# Altium schematic sheet STM32G473CET6_PINOUT.SchDoc
size C; SheetNumber: 6; SheetTotal: 6
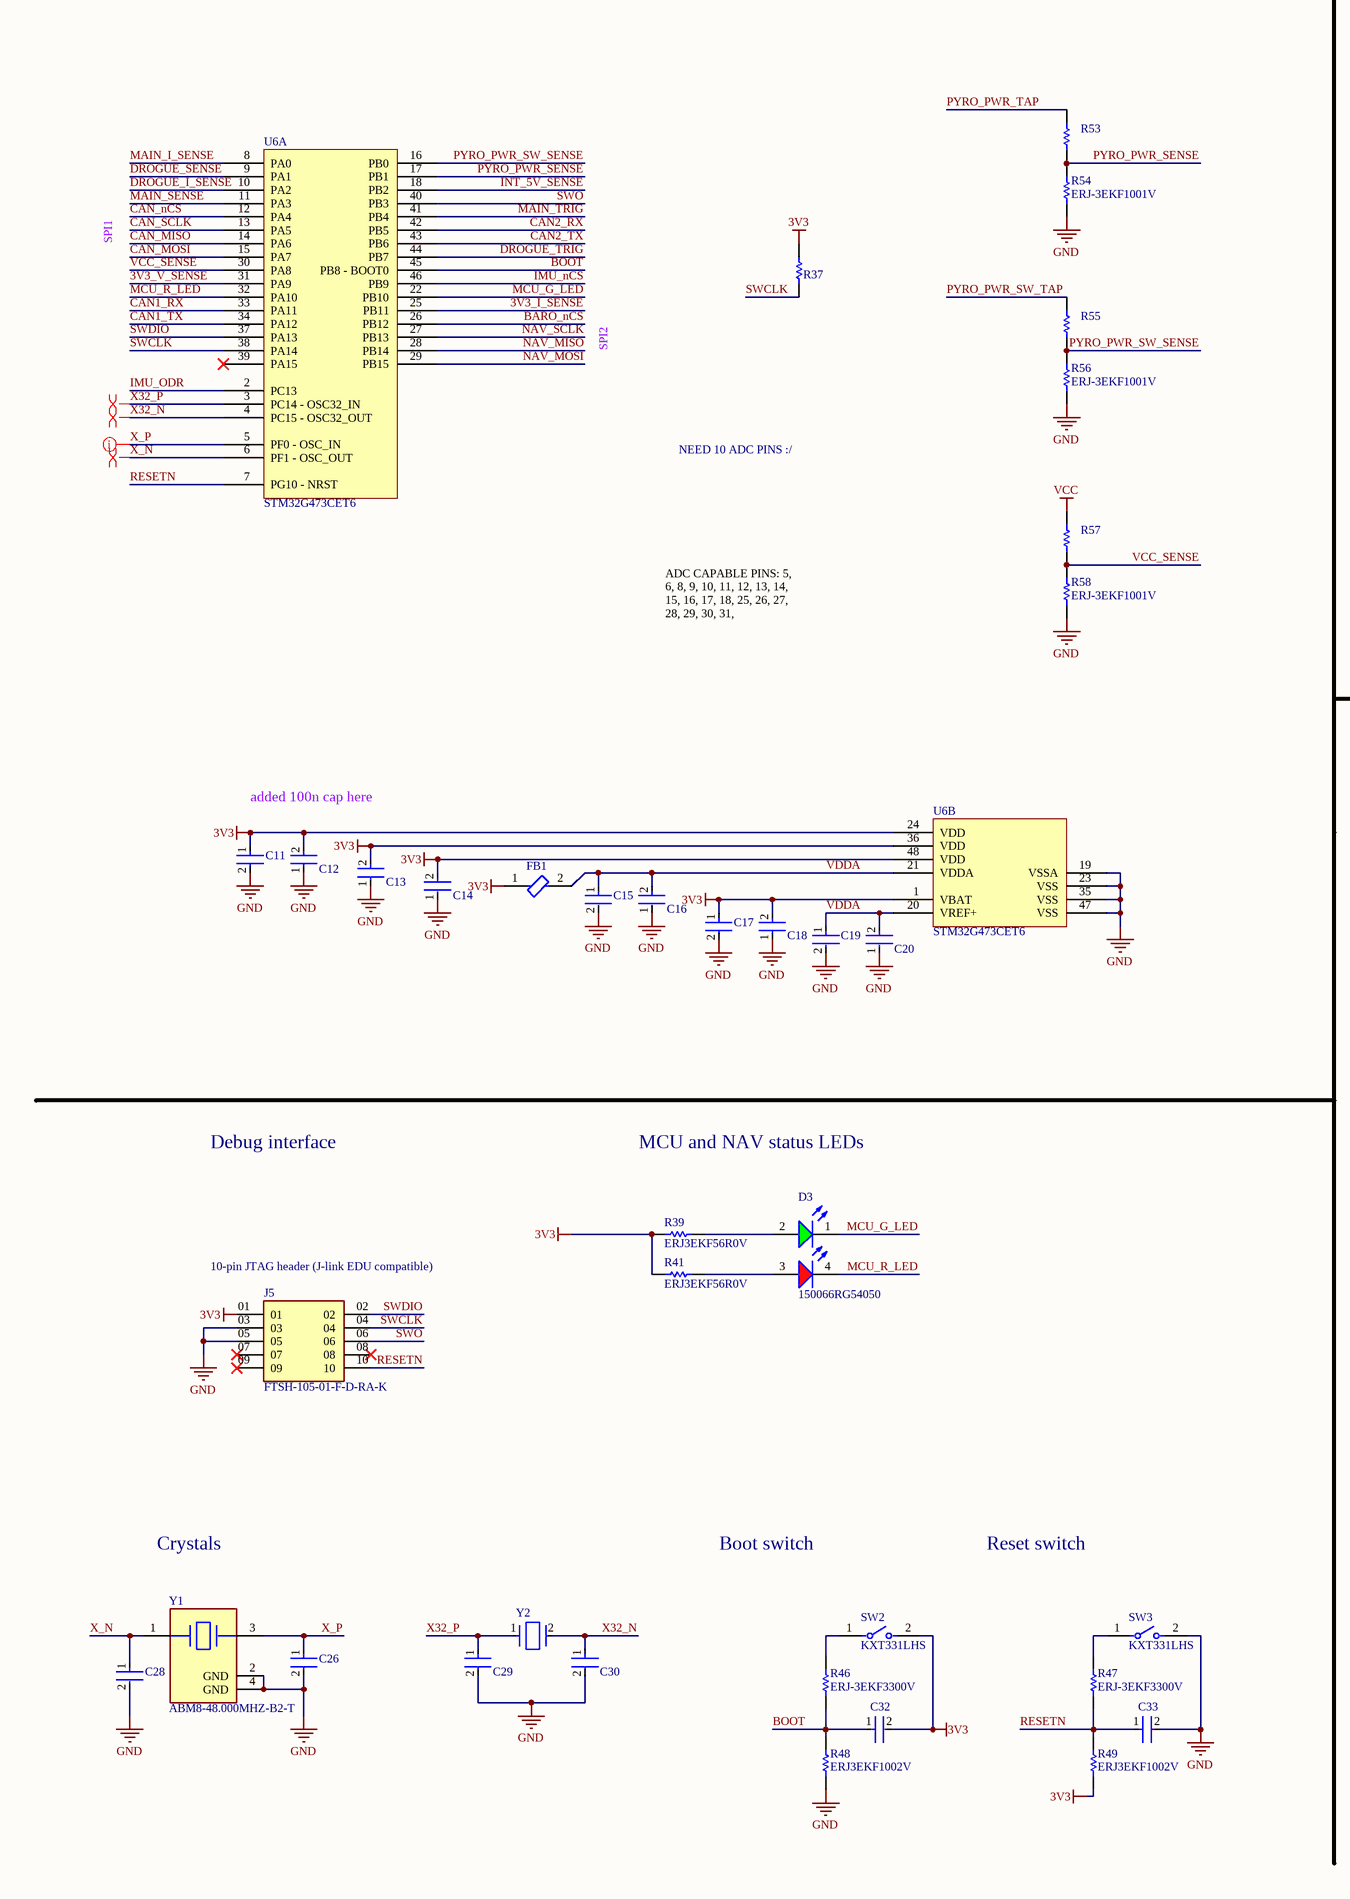
[diagram p0: STM32G473CET6_PINOUT.SchDoc, left]
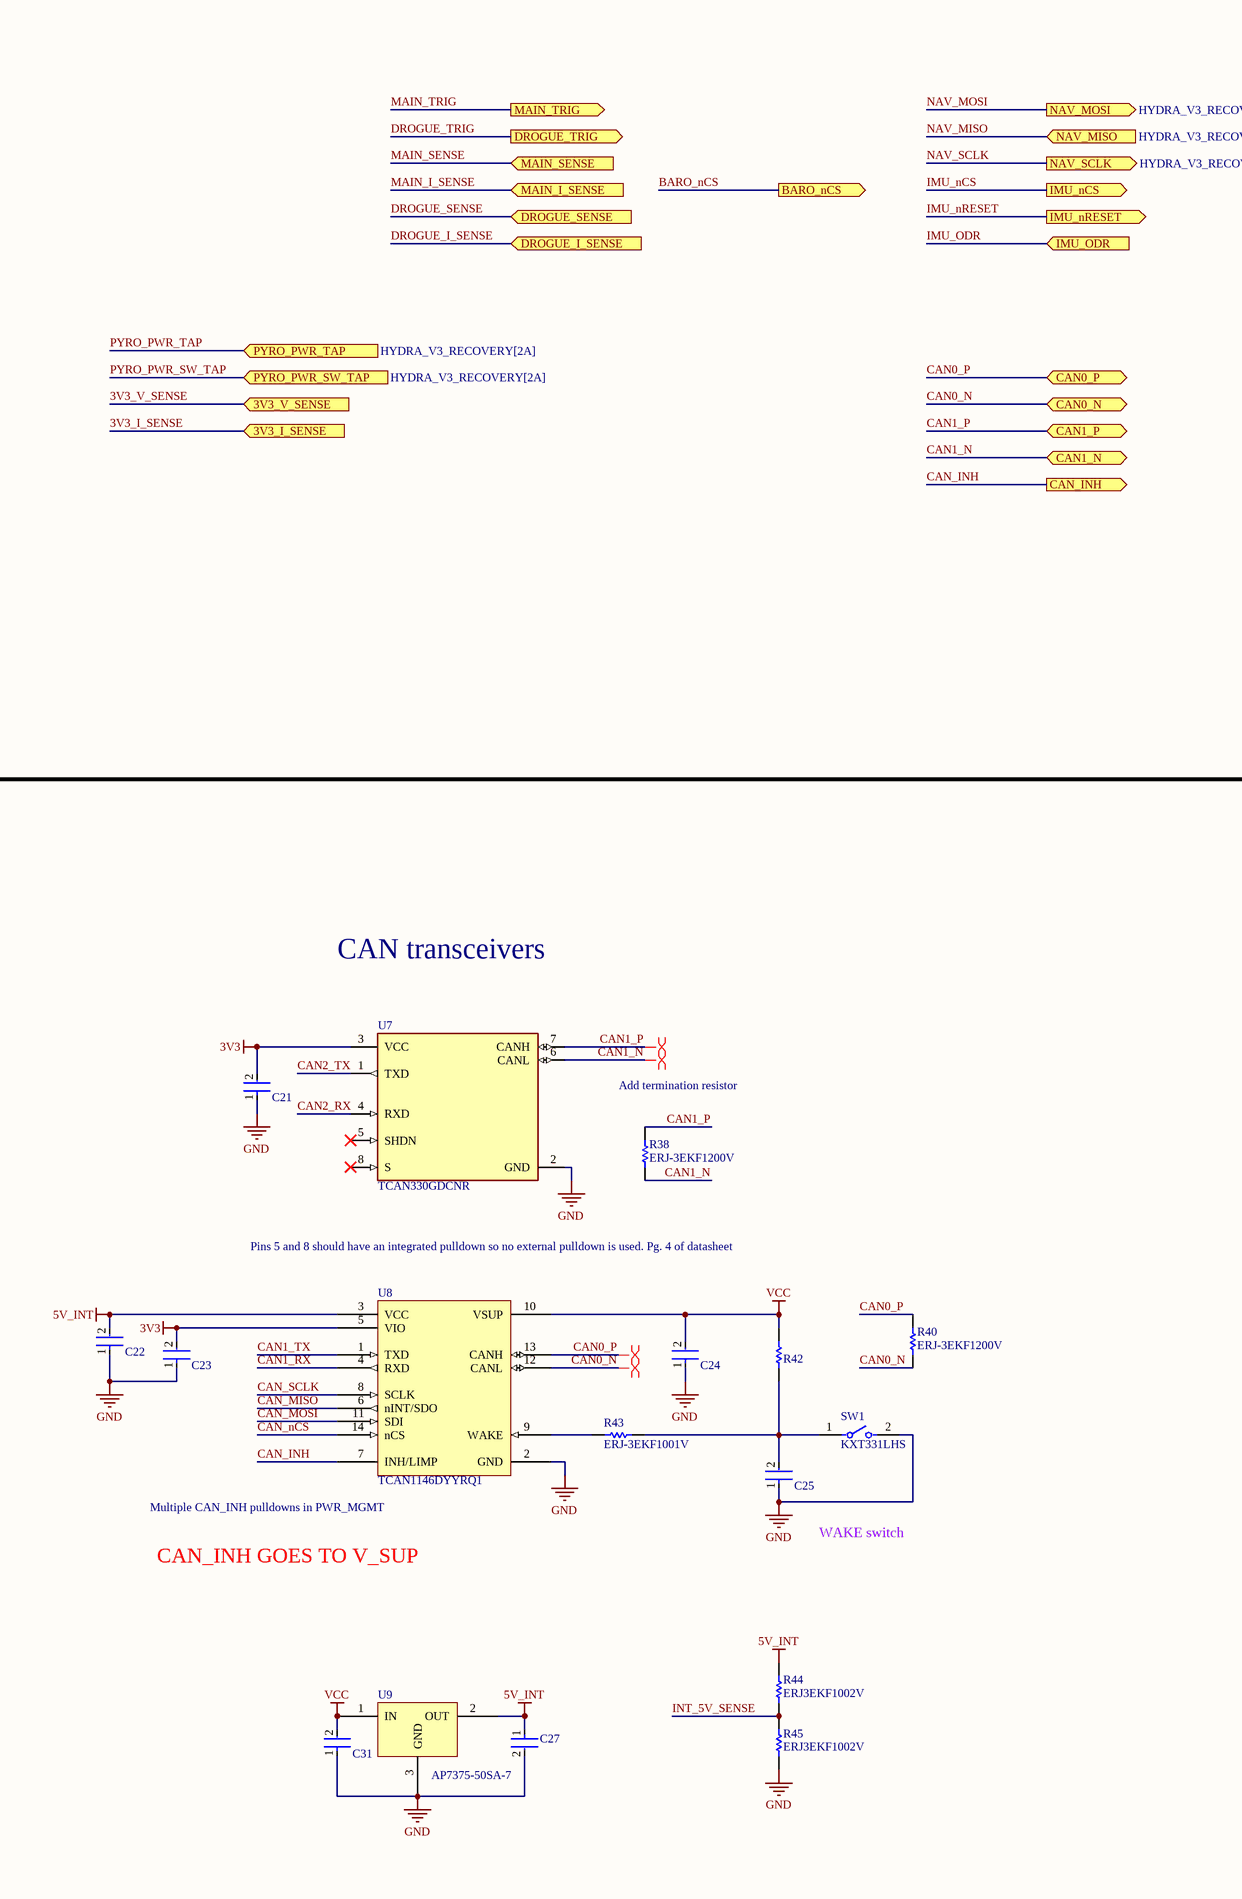
[diagram p1: STM32G473CET6_PINOUT.SchDoc, right]

## Parts
C11  C1005X5R1A475K050BC  [FP-C1005-050-0_15-MFG]  (value not drawn)
C12  GRM155R71C104KA88D  [FP-GRM15-MFG]  (value not drawn)
C13  GRM155R71C104KA88D  [FP-GRM15-MFG]  (value not drawn)
C14  GRM155R71C104KA88D  [FP-GRM15-MFG]  (value not drawn)
C15  EMK105BJ105KV-F  [FP-0402-L_1_0_0_05-W_0_5-IPC_A]  (value not drawn)
C16  GRM155R71C104KA88D  [FP-GRM15-MFG]  (value not drawn)
C17  EMK105BJ105KV-F  [FP-0402-L_1_0_0_05-W_0_5-IPC_A]  (value not drawn)
C18  GRM155R71C104KA88D  [FP-GRM15-MFG]  (value not drawn)
C19  EMK105BJ105KV-F  [FP-0402-L_1_0_0_05-W_0_5-IPC_A]  (value not drawn)
C20  GRM155R71C104KA88D  [FP-GRM15-MFG]  (value not drawn)
C21  C0402C104K8PACTU  [FP-C0402-BB-MFG]  (value not drawn)
C22  C0402C104K8PACTU  [FP-C0402-BB-MFG]  (value not drawn)
C23  C0402C104K8PACTU  [FP-C0402-BB-MFG]  (value not drawn)
C24  C0402C104K8PACTU  [FP-C0402-BB-MFG]  (value not drawn)
C25  C0402C104K8PACTU  [FP-C0402-BB-MFG]  (value not drawn)
C26  C0402C689C5GACTU  [FP-C0402-BB-MFG]  (value not drawn)
C27  CL05A106MP5NUNC  [FP-CL05A106MP5NUNC-MFG]  (value not drawn)
C28  C0402C689C5GACTU  [FP-C0402-BB-MFG]  (value not drawn)
C29  04025A180FAT2A  [FP-0402-L_1_0_1-W_0_5_0_1-IPC_A]  (value not drawn)
C30  04025A180FAT2A  [FP-0402-L_1_0_1-W_0_5_0_1-IPC_A]  (value not drawn)
C31  C0402C104K8PACTU  [FP-C0402-BB-MFG]  (value not drawn)
C32  C0402C104K8PACTU  [FP-C0402-BB-MFG]  (value not drawn)
C33  C0402C104K8PACTU  [FP-C0402-BB-MFG]  (value not drawn)
D3  150066RG54050  [WL-SBCD_0606]
FB1  BLM15PX601SN1D  [FP-BLM15-0_05-MFG]  (value not drawn)
J5  FTSH-105-01-F-D-RA-K  [FTSH-105-01-F-D-RA-K-Footprint-1]
R37  ERJ3EKF1002V  [RESC1609X55X30LL15T15]  (value not drawn)
R38  ERJ-3EKF1200V  [RESC1609X55X30ML15T15]
R39  ERJ3EKF56R0V  [RESC1608X55X30NL15T15]
R40  ERJ-3EKF1200V  [RESC1609X55X30ML15T15]
R41  ERJ3EKF56R0V  [RESC1608X55X30NL15T15]
R42  ERJ3EKF1002V  [RESC1609X55X30LL15T15]  (value not drawn)
R43  ERJ-3EKF1001V  [RESC1608X55X30LL15T15]
R44  ERJ3EKF1002V  [RESC1609X55X30LL15T15]
R45  ERJ3EKF1002V  [RESC1609X55X30LL15T15]
R46  ERJ-3EKF3300V  [RESC1608X55X30LL15T15]
R47  ERJ-3EKF3300V  [RESC1608X55X30LL15T15]
R48  ERJ3EKF1002V  [RESC1609X55X30LL15T15]
R49  ERJ3EKF1002V  [RESC1609X55X30LL15T15]
R53  ERJ3EKF1002V  [RESC1609X55X30LL15T15]  (value not drawn)
R54  ERJ-3EKF1001V  [RESC1608X55X30LL15T15]
R55  ERJ3EKF1002V  [RESC1609X55X30LL15T15]  (value not drawn)
R56  ERJ-3EKF1001V  [RESC1608X55X30LL15T15]
R57  ERJ3EKF1002V  [RESC1609X55X30LL15T15]  (value not drawn)
R58  ERJ-3EKF1001V  [RESC1608X55X30LL15T15]
SW1  KXT331LHS  [FP-KXT331LHS-MFG]
SW2  KXT331LHS  [FP-KXT331LHS-MFG]
SW3  KXT331LHS  [FP-KXT331LHS-MFG]
U6  STM32G473CET6  [TSQFP50P900X900X160-48N]  (parts A,B of 2)
U7  TCAN330GDCNR  [FP-DCN0008A-MFG]
U8  TCAN1146DYYRQ1  [TCAN1146DYYRQ1-Footprint-1]
U9  AP7375-50SA-7  [AP7375-50SA-7-Footprint-1]
Y1  ABM8-48.000MHZ-B2-T  [FP-ABM8-MFG]
Y2  ECS-.327-12.5-1210-TR  [FP-ECX-1210-MFG]  (value not drawn)

## Ports
3V3_I_SENSE (in, see HYDRA_V3_RECOVERY[2A], OC_PROT[6A]), 3V3_V_SENSE (in, see HYDRA_V3_RECOVERY[2A], OC_PROT[6A]), BARO_nCS (out, see HYDRA_V3_RECOVERY[3A], SENSOR_BANK[4A]), CAN0_N (bidir, see HYDRA_V3_RECOVERY[3B]), CAN0_P (bidir, see HYDRA_V3_RECOVERY[3B]), CAN1_N (bidir, see HYDRA_V3_RECOVERY[3B]), CAN1_P (bidir, see HYDRA_V3_RECOVERY[3B]), CAN_INH (out, see HYDRA_V3_RECOVERY[2B], OC_PROT[1A]), DROGUE_I_SENSE (in, see HYDRA_V3_RECOVERY[3A], EJECTION_CIRCUIT[5A]), DROGUE_SENSE (in, see HYDRA_V3_RECOVERY[3A], EJECTION_CIRCUIT[5A]), DROGUE_TRIG (out, see HYDRA_V3_RECOVERY[3A], EJECTION_CIRCUIT[1A]), IMU_nCS (out, see HYDRA_V3_RECOVERY[3A], SENSOR_BANK[4B]), IMU_nRESET (out, see HYDRA_V3_RECOVERY[3B], SENSOR_BANK[4B]), IMU_ODR (in, see HYDRA_V3_RECOVERY[3B], SENSOR_BANK[4B]), MAIN_I_SENSE (in, see HYDRA_V3_RECOVERY[3A], EJECTION_CIRCUIT[5A]), MAIN_SENSE (in, see HYDRA_V3_RECOVERY[3A], EJECTION_CIRCUIT[5A]), MAIN_TRIG (out, see HYDRA_V3_RECOVERY[3A], EJECTION_CIRCUIT[1A]), NAV_MISO (in, see HYDRA_V3_RECOVERY[3A]), NAV_MOSI (out, see HYDRA_V3_RECOVERY[3A]), NAV_SCLK (out, see HYDRA_V3_RECOVERY[3A]), PYRO_PWR_SW_TAP (in, see HYDRA_V3_RECOVERY[2A]), PYRO_PWR_TAP (in, see HYDRA_V3_RECOVERY[2A])

## Nets
3V3: C11.1 C12.2 C13.2 C14.2 C17.1 C18.2 C21.2 C23.2 C32.2 FB1.1 J5.01 R37.1 R39.2 R41.2 R49.1 SW2.2 U6.1(VBAT) U6.24(VDD) U6.36(VDD) U6.48(VDD) U7.3(VCC) U8.5(VIO)
5V_INT: C22.2 C27.1 R44.2 U8.3(VCC) U9.2(OUT)
GND: C11.2 C12.1 C13.1 C14.1 C15.2 C16.1 C17.2 C18.1 C19.2 C20.1 C21.1 C22.1 C23.1 C24.1 C25.1 C26.2 C27.2 C28.2 C29.2 C30.2 C31.1 C33.2 J5.03 J5.05 R45.2 R48.1 R54.2 R56.2 R58.2 SW1.2 SW3.2 U6.19(VSSA) U6.23(VSS) U6.35(VSS) U6.47(VSS) U7.2(GND) U8.2(GND) U9.3(GND) Y1.2(GND) Y1.4(GND)
VCC: C24.2 C31.2 R42.1 R57.1 U8.10(VSUP) U9.1(IN)
3V3_I_SENSE: U6.25(PB11) ; port 3V3_I_SENSE
3V3_V_SENSE: U6.31(PA9) ; port 3V3_V_SENSE
BARO_nCS: U6.26(PB12) ; port BARO_nCS
BOOT: C32.1 R46.1 R48.2 U6.45(PB8_-_BOOT0)
CAN0_N: R40.2 U8.12(CANL) ; port CAN0_N
CAN0_P: R40.1 U8.13(CANH) ; port CAN0_P
CAN1_N: R38.1 U7.6(CANL) ; port CAN1_N
CAN1_P: R38.2 U7.7(CANH) ; port CAN1_P
CAN1_RX: U6.33(PA11) U8.4(RXD)
CAN1_TX: U6.34(PA12) U8.1(TXD)
CAN2_RX: U6.42(PB5) U7.4(RXD)
CAN2_TX: U6.43(PB6) U7.1(TXD)
CAN_INH: U8.7(INH/LIMP) ; port CAN_INH
CAN_MISO: U6.14(PA6) U8.6(nINT/SDO)
CAN_MOSI: U6.15(PA7) U8.11(SDI)
CAN_nCS: U6.12(PA4) U8.14(nCS)
CAN_SCLK: U6.13(PA5) U8.8(SCLK)
DROGUE_I_SENSE: U6.10(PA2) ; port DROGUE_I_SENSE
DROGUE_SENSE: U6.9(PA1) ; port DROGUE_SENSE
DROGUE_TRIG: U6.44(PB7) ; port DROGUE_TRIG
IMU_nCS: U6.46(PB9) ; port IMU_nCS
IMU_nRESET: port IMU_nRESET
IMU_ODR: U6.2(PC13) ; port IMU_ODR
INT_5V_SENSE: R44.1 R45.1 U6.18(PB2)
MAIN_I_SENSE: U6.8(PA0) ; port MAIN_I_SENSE
MAIN_SENSE: U6.11(PA3) ; port MAIN_SENSE
MAIN_TRIG: U6.41(PB4) ; port MAIN_TRIG
MCU_G_LED: D3.1(K) U6.22(PB10)
MCU_R_LED: D3.4(K) U6.32(PA10)
NAV_MISO: U6.28(PB14) ; port NAV_MISO
NAV_MOSI: U6.29(PB15) ; port NAV_MOSI
NAV_SCLK: U6.27(PB13) ; port NAV_SCLK
PYRO_PWR_SENSE: R53.2 R54.1 U6.17(PB1)
PYRO_PWR_SW_SENSE: R55.2 R56.1 U6.16(PB0)
PYRO_PWR_SW_TAP: R55.1 ; port PYRO_PWR_SW_TAP
PYRO_PWR_TAP: R53.1 ; port PYRO_PWR_TAP
RESETN: C33.1 J5.10 R47.1 R49.2 U6.7(PG10_-_NRST)
SWCLK: J5.04 R37.2 U6.38(PA14)
SWDIO: J5.02 U6.37(PA13)
SWO: J5.06 U6.40(PB3)
VCC_SENSE: R57.2 R58.1 U6.30(PA8)
VDDA: C15.1 C16.2 C19.1 C20.2 FB1.2 U6.20(VREF+) U6.21(VDDA)
X32_N: C30.1 U6.4(PC15_-_OSC32_OUT) Y2.2(Out/In)
X32_P: C29.1 U6.3(PC14_-_OSC32_IN) Y2.1(In/Out)
X_N: C28.1 U6.6(PF1_-_OSC_OUT) Y1.1
X_P: C26.1 U6.5(PF0_-_OSC_IN) Y1.3
NetC25_2: C25.2 R42.2 R43.2 SW1.1
NetD3_2: D3.2(A) R39.1
NetD3_3: D3.3(A) R41.1
NetR43_1: R43.1 U8.9(WAKE)
NetR46_2: R46.2 SW2.1
NetR47_2: R47.2 SW3.1

Not connected (* = marked no-connect by the designer): J5 07* 08* 09*; U6 39(PA15)*; U7 5(SHDN)* 8(S)*

## Layout directives
differential pair: CAN1_N, CAN1_P, X32_N, X32_P, X_N, X_P
differential pair; differential pair class 120DIFF: CAN0_N, CAN0_P

## Notes on the sheet
- SPI1
- SPI2
- NEED 10 ADC PINS :/
- ADC CAPABLE PINS: 5, 6, 8, 9, 10, 11, 12, 13, 14, 15, 16, 17, 18, 25, 26, 27, 28, 29, 30, 31,
- added 100n cap here
- CAN transceivers
- (near R38) Add termination resistor
- Debug interface
- MCU and NAV status LEDs
- Pins 5 and 8 should have an integrated pulldown so no external pulldown is used. Pg. 4 of datasheet
- (near J5) 10-pin JTAG header (J-link EDU compatible)
- (near U8) Multiple CAN_INH pulldowns in PWR_MGMT
- WAKE switch
- CAN_INH GOES TO V_SUP
- Crystals
- Boot switch
- Reset switch

## Library data of the parts
C11 = CMP-2000-05997-2: CAP CER 4.7UF 10V X5R 0402; Dielectric Material: Ceramic; Tolerance: 10%; Series: C; Package Quantity: 10000; Max Operating Temperature: 85°C; Case Code (Imperial): 0402; Lead Free: Lead Free; Voltage Rating (DC): 10V; Packaging: Cut Tape; Voltage Rating: 10V; Min Operating Temperature: -55°C; Dielectric: X5R; Thickness: 0.022inch; Width: 0.02inch; Case/Package: 0402; Case Code (Metric): 1005; Capacitance: 4.7uF; Length: 0.039inch; RoHS Compliant: Yes; REACH SVHC: No SVHC; Mount: Surface Mount
C12-C14 C16 C18 C20 = CMP-2100-03641-2: CAP CER 0.1UF 16V X7R 0402; Manufacturer: Murata; Standoff Height: 0mm; Tolerance: 10%; Voltage Rating: 16Vdc; Material: Ceramic; Capacitance: 0.10μF; Value: 0.10μF; RoHS: TRUE; Manufacturer Part Number: GRM155R71C104KA88D; Temperature Characteristic: X7R; Octopart: https://octopart.com/grm155r71c104ka88d-murata-196880; Digikey Description: CAP CER 0.1UF 16V X7R 0402; Device Class L3: Ceramic Capacitors; Height: 0.55mm; ComponentLink2Description: Datasheet; Temperature Range Low: -55°C; Ipc Land Pattern Name: CAPC10050X219; ComponentLink2URL: https://search.murata.co.jp/Ceramy/image/img/A01X/G101/ENG/GRM155R71H471KA01-01A.pdf; Device Class L1: Passive Components; Lead Free: yes; Category: Cap; Package: GRM15; Temperature: -55°C to +125°C; Device Class L2: Capacitors; Temperature Range High: +125°C; Mouser Description: 0402 0.1 uF 16V ±10 % Tolerance X7R SMT Multilayer Ceramic Capacitor
C15 C17 C19 = CMP-14477-000104-2: None; Tolerance: 10%; Voltage Rating: 16V; Dielectric: X5R; Capacitance: 1uF; Packaging: Tape and Reel; Depth: 0.5mm; Mount: Surface Mount; Thickness: 0.022inch; Package Quantity: 1; Min Operating Temperature: -55°C; Series: M; Voltage Rating (DC): 16V; Termination: SMD/SMT; Case/Package: 0402; Number of Pins: 2; Case Code (Imperial): 0402; Length: 1mm; Halogen Free: Halogen Free; Case Code (Metric): 1005; Width: 0.02inch; RoHS Compliant: Yes; Radiation Hardening: No; Max Operating Temperature: 85°C; Height: 0.5mm; Construction: Flat
C21-C25 C31-C33 = CMP-2008-02046-2: CAP CER 0.1UF 10V X5R 0402; Manufacturer: Kemet; Material: Ceramic; Capacitance: 0.10 μF; Temperature Coefficient: 15%; Tolerance: 0.1; Value: 0.10 μF; Package: C0402-BB; Temperature: -55°C to +125°C; ComponentLink2Description: Datasheet; Temperature Characteristic: X5R; Device Class L1: Passive Components; Height: 0.55mm; Lead Free: Yes; ComponentLink2URL: https://content.kemet.com/datasheets/KEM_C1002_X7R_SMD.pdf; Device Class L2: Capacitors; Temperature Range Low: -55°C; Temperature Range High: +125°C; RoHS: TRUE; Octopart: https://octopart.com/c0402c104k8pactu-kemet-140039; Automotive: No; Mouser Description: Capacitor 100 nF 10 VDC 0402; Category: Cap; Voltage Rating: 10 V; Digikey Description: CAP CER 0.1UF 10V X5R 0402; Ipc Land Pattern Name: CAPC10050X50; Device Class L3: Ceramic Capacitors; Manufacturer Part Number: C0402C104K8PACTU
C26 C28 = CMP-1034-00517-3: CAP CER 6.8PF 50V NP0 0402; Manufacturer: Kemet; Material: Ceramic; Temperature Characteristic: C0G; Tolerance: 0.25 pF; Temperature Coefficient: 15%; ComponentLink2URL: https://content.kemet.com/datasheets/KEM_C1002_X7R_SMD.pdf; Octopart: https://octopart.com/c0402c689c5gactu-kemet-9143567; RoHS: TRUE; Temperature: -55°C to +125°C; Device Class L2: Capacitors; ComponentLink2Description: Datasheet; Mouser Description: Cap Ceramic 6.8pF 50V C0G 0.25pF SMD 0402 125°C Paper T/R; Device Class L3: Ceramic Capacitors; Digikey Description: CAP CER 6.8PF 50V NP0 0402; Temperature Range High: +125°C; Package: C0402-BB; Voltage Rating: 50 V; Height: 0.55mm; Ipc Land Pattern Name: CAPC10050X50; Value: 6.8 pF; Device Class L1: Passive Components; Category: Cap; Manufacturer Part Number: C0402C689C5GACTU; Capacitance: 6.8 pF; Lead Free: Yes; Automotive: No; Temperature Range Low: -55°C
C27 = CMP-13271-000002-1: CAP CER 10UF 10V X5R 0402; Manufacturer: Samsung; Temperature Coefficient: 15%; Tolerance: 20%; Material: Ceramic; Octopart: https://octopart.com/cl05a106mp5nunc-samsung-22457395; Voltage Rating: 10V; RoHS: TRUE; Value: 10uF; Height: 0.7mm; Digikey Description: CAP CER 10UF 10V X5R 0402; Automotive: No; Package: CL05A106MP5NUNC; Device Class L1: Passive Components; Capacitance: 10uF; Temperature Range High: +85°C; ComponentLink2Description: Datasheet; Device Class L2: Capacitors; Temperature Characteristic: X5R; Manufacturer Part Number: CL05A106MP5NUNC; Temperature: -55°C to +85°C; ComponentLink2URL: http://www.samsungsem.com/kr/support/product-search/mlcc/__icsFiles/afieldfile/2019/05/10/19-CL05A106MP5NUNC.pdf; Device Class L3: Ceramic Capacitors; Category: Cap; Temperature Range Low: -55°C; Ipc Land Pattern Name: CAPC10050X50; Lead Free: Yes
C29 C30 = CMP-2008-02590-2: General Purpose Ceramic Capacitor, 0402, 18pF, 1%, C0G, 30ppm/°C, 50V; Depth: 0.5mm; Packaging: Tape and Reel; Number of Pins: 2; Tolerance: 1%; Min Operating Temperature: -55°C; Capacitance: 18pF; Termination: SMD/SMT; Lead Free: Lead Free; Case Code (Metric): 1005; Radiation Hardening: No; Package Quantity: 1; Max Operating Temperature: 125°C; Voltage Rating: 50V; Construction: Flat; Dielectric: C0G; Length: 1mm; REACH SVHC: No SVHC; Case Code (Imperial): 0402; Series: -; RoHS Compliant: Yes; Voltage Rating (DC): 50V; Mount: Surface Mount; Case/Package: 0402; Width: 0.5mm; Thickness: 0.022inch; Contact Plating: Tin
D3 = CMP-004-00040-2: Led, Red/Grn, 180Mcd/230Mcd, 624Nm/525Nm Rohs Compliant: Yes; Source: rgled.SchLib; Component Type: Standard; Design Item ID: CMP-004-00034-2; Pins: 4
FB1 = CMP-0686-00252-4: Chip Ferrite Bead, 0402, 600Ω @ 100MHz, 0.23Ω, 25%, 900mA; Number of Circuits: 1; Impedance: 600R; DC Resistance (DCR): 230mR; Material: Steel; Length: 1mm; Package Quantity: 10000; Height: 0.5mm; Width: 0.5mm; Max DC Current: 900mA; Number of Lines: 1; Termination: SMD/SMT; Packaging: Tape and Reel; Lead Free: Lead Free; Min Operating Temperature: -55°C; Max Operating Temperature: 125°C; Max Current Rating: 900mA; Case Code (Imperial): 0402; Number of Pins: 2; Current Rating: 900mA; Test Frequency: 100MHz; Case/Package: 0402; Tolerance: 25%; Case Code (Metric): 1005
J5 = CMP-002-00041-5: Board Connector, 10 Contact(s), 2 Row(s), Male, Right Angle, 0.05 inch Pitch, Surface Mount Terminal, Locking, Black Insulator; Connector Type: BOARD CONNECTOR; Mounting Technology: Board; RoHS Compliant: Yes
R37 R42 R44 R45 R48 R49 R53 R55 R57 = CMP-1012-00623-3: Chip Resistor, 10 KOhm, +/- 1%, 0.1 W, -55 to 155 degC, 0603 (1608 Metric), RoHS, Tape and Reel; Manufacturer: Panasonic; Voltage Rating: 75V; Case\/Package: 0603; Power Rating: 100mW; Resistance: 10KOhm; Temperature Coefficient: 100ppm\/degreesC; Number of Pins: 2; Package Reference: 603; Depth: 0.8mm; Mount: SurfaceMount; Package Description: 2-Pin Surface Mount Device, Body 1.6 x 0.85 mm; Datasheet Version: 02/2017; Length: 1.6mm; Lead Free: LeadFree; Height: 0.45mm; Number of Terminations: 2; Max Power Dissipation: 100mW; Min Operating Temperature: -55degC; Datasheet URL: https://industrial.panasonic.com/cdbs/www-data/pdf/RDA0000/AOA0000C304.pdf; Termination: SMD/SMT; Case Code (Metric): 1608; Case Code (Imperial): 0603; Tolerance: 1%; Max Operating Temperature: 155degC; RoHSCompliant: true; Voltage Rating (DC): 75V; Radiation Hardening: No; Packaging: TapeandReel; Composition: ThickFilm; Mounting Technology: SurfaceMount; Manufacturer URL: http://www.panasonic.com/; Width: 0.031inch; REACH SVHC: NoSVHC; Contact Plating: Tin; Military Standard: Not; Package Quantity: 1
R38 R40 = CMP-2000-00213-2: Chip Resistor, 120 Ohm, +/- 1%, 0.1 W, -55 to 155 degC, 0603 (1608 Metric), RoHS, Tape and Reel; Manufacturer: Panasonic; Power Rating: 100mW; Voltage Rating (DC): 75V; Resistance: 120Ohm; Temperature Coefficient: 100ppm/degreesC; Number of Terminations: 2; Military Standard: Not; Tolerance: 1%; Min Operating Temperature: -55degC; Packaging: TapeandReel; Lead Free: LeadFree; Max Operating Temperature: 155degC; Manufacturer URL: http://www.panasonic.com/; Case Code (Imperial): 0603; REACH SVHC: NoSVHC; Width: 0.031inch; Datasheet URL: https://industrial.panasonic.com/cdbs/www-data/pdf/RDA0000/AOA0000C283.pdf; RoHSCompliant: true; Max Power Dissipation: 100mW; Termination: SMD/SMT; Package Reference: 0603; Height: 0.022inch; Depth: 0.8mm; Package Description: 2-Pin Surface Mount Device, Body 1.6 x 0.85 mm; Contact Plating: Tin; Length: 1.6mm; Package URL: http://www.st.com/st-web-ui/static/active/en/resource/technical/document/datasheet/CD00001320.pdf; Radiation Hardening: No; Package Quantity: 1; Number of Pins: 2; Datasheet Version: 42095.0; Voltage Rating: 75V; Composition: ThickFilm; Case/Package: 0603; Mount: SurfaceMount; Case Code (Metric): 1608
R39 R41 = CMP-2000-00572-1: Manufacturer: Panasonic; Part Number: ERJ3EKF56R0V
R43 R54 R56 R58 = CMP-2000-00180-1: Manufacturer: Panasonic; Part Number: ERJ-3EKF1001V
R46 R47 = CMP-2000-00435-2: Chip Resistor, 330 Ohm, +/- 1%, 0.1 W, -55 to 155 degC, 0603 (1608 Metric), RoHS, Tape and Reel; Gender: Male; Mating Cycles: 10000; Current Rating: 500 mA; Voltage Rating: 10 V; REACH SVHC: No SVHC; PackageDescription: 2-Pin Surface Mount Device, Body 1.6 x 0.85 mm; Contact Finish: Gold; Pins: 8; ComponentLink1Description: Manufacturer URL; Packaging: Tape and Reel; Max Operating Temperature: 85 degC; Contact Material: Copper; Height: 1.45 mm; Width: 1.45 mm; DatasheetVersion: Apr-15; Package Quantity: 1500; Contact Plating: Gold; PackageReference: 0603; Mount: Surface Mount; Lead Pitch: 1.1 mm; Min Operating Temperature: -25 degC; ComponentLink1URL: http://www.panasonic.com/; ComponentLink2URL: http://industrial.panasonic.com/cdbs/www-data/pdf/RDA0000/AOA0000C86.pdf; Length: 13.7 mm; ComponentLink2Description: Datasheet; RoHSCompliant: true
SW1-SW3 = CMP-10040-000029-1: SWITCH TACTILE SPST-NO 0.02A 15V; Operating Force: 240gf; Switch Travel: 0.13mm; Illumination Type: Non-Illuminated; Throw Configuration: SPST; Number of Ports: 1; Current Rating: 5A; Mechanical Life: 500000Cycles; Switch Function: Off-Mom; Connector Type: USB; Actuator Type: Standard; Gender: Receptacle; Number of Contacts: 24; Contact Plating: Gold; Insulation Color: Black; Min Operating Temperature: -40°C; Packaging: Tape and Reel; Flammability Rating: UL94 V-0; Max Operating Temperature: 85°C; Termination: Solder; Mount: Surface Mount
U6 = CMP-020-00018-2: RISC Microcontroller, 32-Bit, 170MHz; RoHS Compliant: Yes
U7 = CMP-04872-000178-1: IC TRANSCEIVER 1/1 SOT23-8; Data Rate: 1Mbps; Packaging: Tape and Reel; Min Operating Temperature: -40°C; Max Operating Temperature: 125°C; RoHS Compliant: Yes; Lead Free: Lead Free; Case/Package: SOT-23-8; Mount: Surface Mount
U8 = CMP-318-000000-2: Automotive CAN FD transceiver with watchdog, bus diagnostics and partial networking via sele 14-SOT-23-THIN -40 to 150; Component Type: Standard; Design Item ID: CMP-015-00012-2; Pin Count: 14; Source: TCAN1146DYYRQ1.SchLib
U9 = CMP-019-00041-1: Ldo Cmos Lowcurr SOT23 T&r 3K
Y1 = CMP-27762-011708-1: Crystal 48MHz ±20ppm 18pF SMD-4 3.2mm x 2.5mm; Series Resistance: 35R; Frequency Stability: 50ppm; Package Quantity: 1000; Packaging: Tape and Reel; Mount: Surface Mount; Length: 3.2mm; Load Capacitance: 18pF; Max Operating Temperature: 70°C; Operating Frequency: 48 MHz; RoHS Compliant: Yes; Series: ABM8; Frequency Tolerance: 20ppm; Lead Free: Lead Free; Min Operating Temperature: -20°C; Case/Package: CSMD; Number of Pins: 4; Height: 0.031inch; ESR (Equivalent Series Resistance): 35R; Frequency: 48MHz; Radiation Hardening: No; Width: 0.098inch; Tolerance: 20ppm; Termination: SMD/SMT; Depth: 2.5mm; Resistor Type: Ceramic; REACH SVHC: No SVHC
Y2 = CMP-40224-000006-1: CRYSTAL 32.7680KHZ 12.5PF SMD; Manufacturer: ECS International; Frequency: 32.768kHz; Esr: 90kΩ; Tolerance: 20ppm; Device Class L1: Passive Components; Load Capacitance: 12.5pF; Temperature: -40°C to +85°C; ComponentLink2URL: https://ecsxtal.com/store/pdf/ECX-1210.pdf; Series: ECX-1210; Octopart: https://octopart.com/ecs-.327-12.5-1210-tr-ecs+international-81221340; ComponentLink2Description: Datasheet; Temperature Range Low: -40°C; Digikey Description: CRYSTAL 32.7680KHZ 12.5PF SMD; Lead Free: Yes; RoHS: TRUE; Device Class L3: Crystals; Automotive: No; Category: Crys; Height: 0.5mm; Manufacturer Part Number: ECS-.327-12.5-1210-TR; Temperature Range High: +85°C; Device Class L2: Crystals / Oscillators; Package: ECX-1210